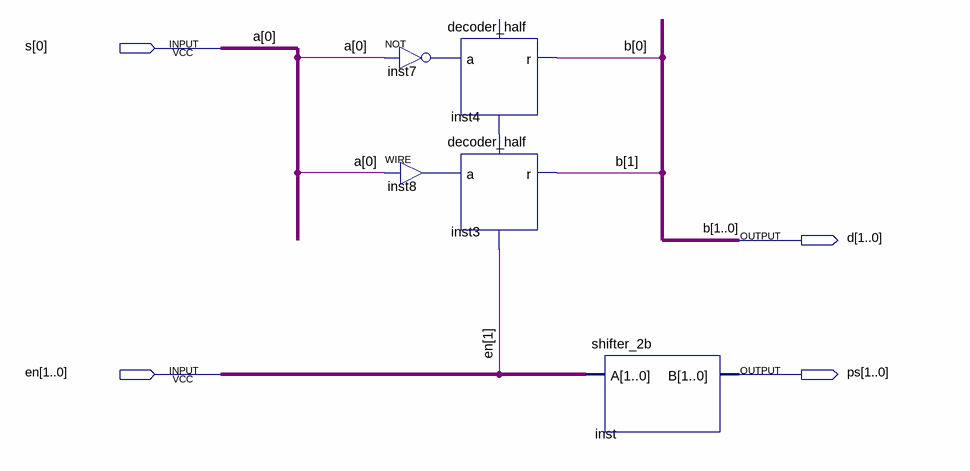
[diagram p0: schematic sheet]
// Quartus schematic decoder_1b.bdf as structural Verilog: 5 symbols, 4 pins
module decoder_1b (
  input  [0:0] s,
  input  [1:0] en,
  output [1:0] d,
  output [1:0] ps
);

  wire inst3_ps, inst7_out, inst8_out;

  decoder_half inst4 (.a(inst7_out), .en(inst3_ps), .r(d[0]));  // open: ps
  not inst7 (inst7_out, s[0]);
  decoder_half inst3 (.a(inst8_out), .en(en[1]), .r(d[1]), .ps(inst3_ps));
  assign inst8_out = s[0];  // WIRE inst8
  shifter_2b inst (.A(en), .B(ps));

  // Other names for the same wires on the sheet: a[0] = s[0]; b[1:0] = d
endmodule
